# Altium project voice_palyer_test.PrjPcb
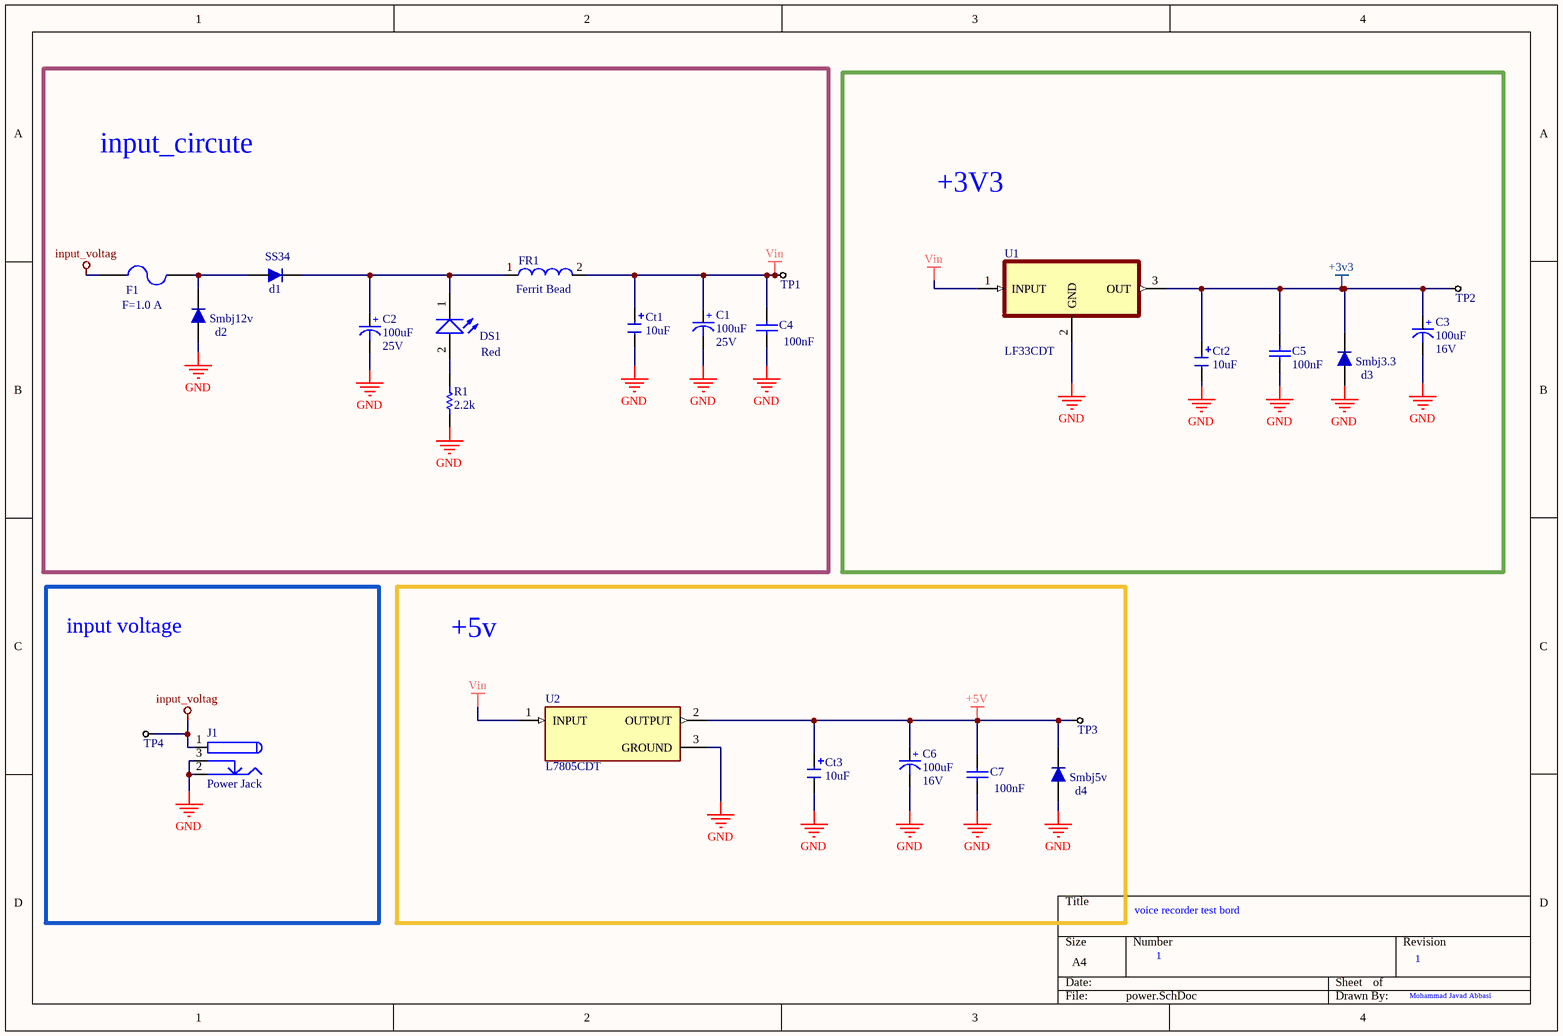
[diagram p0: power.SchDoc]
3 sheets, 98 parts. Net scope: global (net labels, ports and power ports of the same name join across sheets).
Board file: PCB1.PcbDoc
Sheets:
  power.SchDoc
  MCU.SchDoc
  other.SchDoc

## Sheet power.SchDoc
size A4; SheetNumber: 1; SheetTotal: 3

### Parts
C1  Voltage: 25V  [cap 03]  (hidden comment: 100uF)
C2  Voltage: 25V  [cap 03]  (hidden comment: 100uF)
C3  Voltage: 16V  [cap 03]  (hidden comment: 100uF)
C4  value 100nF  [CAP805]
C5  value 100nF  [CAP805]
C6  Voltage: 16V  [cap 03]  (hidden comment: 100uF)
C7  value 100nF  [CAP805]
Ct1  10uF  [Tantalium Size B]
Ct2  10uF  [Tantalium Size B]
Ct3  10uF  [Tantalium Size B]
d1  SS34  [DIODE SMA (DO-214AC)]
d2  Smbj12v  [DIODE SMA (DO-214AC)]
d3  Smbj3.3  [DIODE SMA (DO-214AC)]
d4  Smbj5v  [DIODE SMA (DO-214AC)]
DS1  Red  [LED 1206]
F1  F=1.0 A  [1206 FUSE]
FR1  Ferrit Bead  [RES1206]
J1  Power Jack  [Power Jack]
R1  2.2k  [RES0805]
TP1  (no value)  [TP10]
TP2  (no value)  [TP10]
TP3  (no value)  [TP10]
TP4  (no value)  [TP10]
U1  LF33CDT  [TO228P972X240-3N]
U2  L7805CDT  [VREG_L7805CDT]

### Blocks framed on the sheet
input_circute: C1 C2 C4 Ct1 d1 d2 DS1 F1 FR1 R1 TP1
+3V3: C3 C5 Ct2 d3 TP2 U1
input voltage: J1 TP4
+5v: C6 C7 Ct3 d4 TP3 U2

### Nets
+3v3: C3.1(+) C5.2 Ct2.1 d3.2 TP2.1(TP) U1.3(OUT)
+5V: C6.1(+) C7.2 Ct3.1 d4.2 TP3.1(TP) U2.2(OUTPUT)
GND: C1.2(-) C2.2(-) C3.2(-) C4.1 C5.1 C6.2(-) C7.1 Ct1.2 Ct2.2 Ct3.2 d2.1 d3.1 d4.1 J1.2 J1.3 R1.1 U1.2(GND) U2.3(GROUND)
input_voltag: F1.1 J1.1 TP4.1(TP)
Vin: C1.1(+) C4.2 Ct1.1 FR1.2 TP1.1(TP) U1.1(INPUT) U2.1(INPUT)
NetC2_1: C2.1(+) d1.2 DS1.1(K) FR1.1
Netd1_1: d1.1 d2.2 F1.2
NetDS1_2: DS1.2(A) R1.2

### Notes on the sheet
- voice recorder test bord
- 1
- Mohammad Javad Abbasi

### Library data of the parts
C1-C3 C6 = CAP_Polar: Polar Capacitor; Designer: Eng. Saeid Jorablo; Company: SJ Libraries; ComponentLink1Description: Datasheet; ComponentLink2Description: Reference; Publisher: SJ Unlimited; Mounting Technology: Surface Mount\Through-Hole; HelpURL: http://s3.picofile.com/file/7443264187/Coming_Soon_logo.gif; Status: Unreleased; Value: 100uF
C4 C5 C7 = Cap: Capacitor; Published: 8-Jun-2000; LatestRevisionDate: 17-Jul-2002; LatestRevisionNote: Re-released for DXP Platform.; Publisher: Altium Limited
Ct1-Ct3 = Capacitor Tantalium: Tantalium Cap 10uF .... 100uF; Value: 10uF
d1 = 1n4007 SMD M7: soutkey diod; Part. No: M7; Manufacturer: DC COMPONENTS; Designer: Abbas Basereh; Link: http://www.tme.eu/en/details/m7/smd-universal-diodes/dc-components/; Link: https://www.aliexpress.com/item/Smd-tube-1n4007-m7-SMA/1213719741.html?spm=2114.01010208.3.1.ZyZ7bC&ws_ab_test=searchweb0_0,searchweb201602_4_10065_10068_10084_10083_10080_10082_10081_10060_10061_10062_10056_10055_10054_10059_10099_10078_10079_427_10073_10103_10102_10096_10052_10050_10051,searchweb201603_4&btsid=db2be5ca-e560-400a-b91c-484ab5ee228b; Data: 16-12-2016
d2-d4 = 1n4007 SMD M7: Smbj5.0; Part. No: M7; Manufacturer: DC COMPONENTS; Designer: Abbas Basereh; Link: http://www.tme.eu/en/details/m7/smd-universal-diodes/dc-components/; Link: https://www.aliexpress.com/item/Smd-tube-1n4007-m7-SMA/1213719741.html?spm=2114.01010208.3.1.ZyZ7bC&ws_ab_test=searchweb0_0,searchweb201602_4_10065_10068_10084_10083_10080_10082_10081_10060_10061_10062_10056_10055_10054_10059_10099_10078_10079_427_10073_10103_10102_10096_10052_10050_10051,searchweb201603_4&btsid=db2be5ca-e560-400a-b91c-484ab5ee228b; Data: 16-12-2016
DS1 = LED SMD PACKAGE: SMD Mono-color Chip LED Waterclear; Part Number: 150080BS75000; Peak Wavelength: 465 nm; Forward Voltage: 3.2 V; Published Date: Jan 2017; Publisher: Ali Hafizi
F1 = Fuse SMD1206: SMD Fuses 1206; Designer: Abbas Basereh; Desc.: SMD Fuses 1206; Data: 16-12-2016
J1 = Power Jack: Designer: Saeid Jorablo; Company: Personal; Project Name: Laser; Adding Date: 10/21/2009
R1 = RES 0805 0.125W_1: RES 0805; Designer: Abbas Basereh; Desc.: RES SMD 0805; Data: 16-12-2016
TP1-TP4 = Test Point: Company: SJ Libraries; Designer: Eng. Saeid Jorablo; Mounting Technology: Surface Mount\Through-Hole; ComponentLink1Description: Datasheet; Pin Count: 0; Update Date: 6/3/2012; Category: MISC; HelpURL: http://s3.picofile.com/file/7443264187/Coming_Soon_logo.gif
U1 = LF33CDT: LDO, 0.45VDO, 1A, 3.3V, 1%, 3TO252; MF: {'manufacturer': u'STMicroelectronics'}; Package: None; Price: None; Value: *; MP: LF33CDT; Availability: Unavailable
U2 = L7805CDT: MF: {'manufacturer': u'STMicroelectronics'}; Package: None; Price: None; Value: *; MP: L7805CDT; Availability: Unavailable

## Sheet MCU.SchDoc
size A3; SheetNumber: 2; SheetTotal: 3; SPICEModelCacheLCPKTQCQ: <root> / <DocumentId>LCPKTQCQ</DocumentId> / <CacheFrame Number="0"> / <Model Name="hdsp_303a" Kind="CKT"> / <Text>* / * Diode Model Produced by Altium Ltd / * Date:  10-Mar-2004 / * / * Manufacturer: Agilent / * Component Name: HDSP-303A / * / * Parameters derived from information available in data sheet. / * / *                 anode-G / *                 |  anode-F / *                 |  |  comon-cathode / *                 |  |  |  anode-E / *                 |  |  |  |  anode-D / *                 |  |  |  |  |  anode-DP / *                 |  |  |  |  |  |  anode-C / *                 |  |  |  |  |  |  |  comon-cathode / *                 |  |  |  |  |  |  |  |  anode-B / *                 |  |  |  |  |  |  |  |  |  anode-A / *                 |  |  |  |  |  |  |  |  |  | / .SUBCKT HDSP_303A 1  2  3  4  5  6  7  8  9  10 / DA1  10  3  dHDSP_303A / DB1   9  3  dHDSP_303A / DC1   7  3  dHDSP_303A / DD1   5  3  dHDSP_303A / DE1   4  3  dHDSP_303A / DF1   2  3  dHDSP_303A / DG1   1  3  dHDSP_303A / DDP1  6  3  dHDSP_303A / DA2  10  8  dHDSP_303A / DB2   9  8  dHDSP_303A / DC2   7  8  dHDSP_303A / DD2   5  8  dHDSP_303A / DE2   4  8  dHDSP_303A / DF2   2  8  dHDSP_303A / DG2   1  8  dHDSP_303A / DDP2  6  8  dHDSP_303A / .MODEL dHDSP_303A D / + ( / +    IS = 4.59961571E-15 / +     N = 2.40621673 / +    RS = 1.90931135 / +    BV = 4.5 / +   IBV = 100u / + ) / .ENDS HDSP_303A</Text> / </Model> / </CacheFrame> / </root>
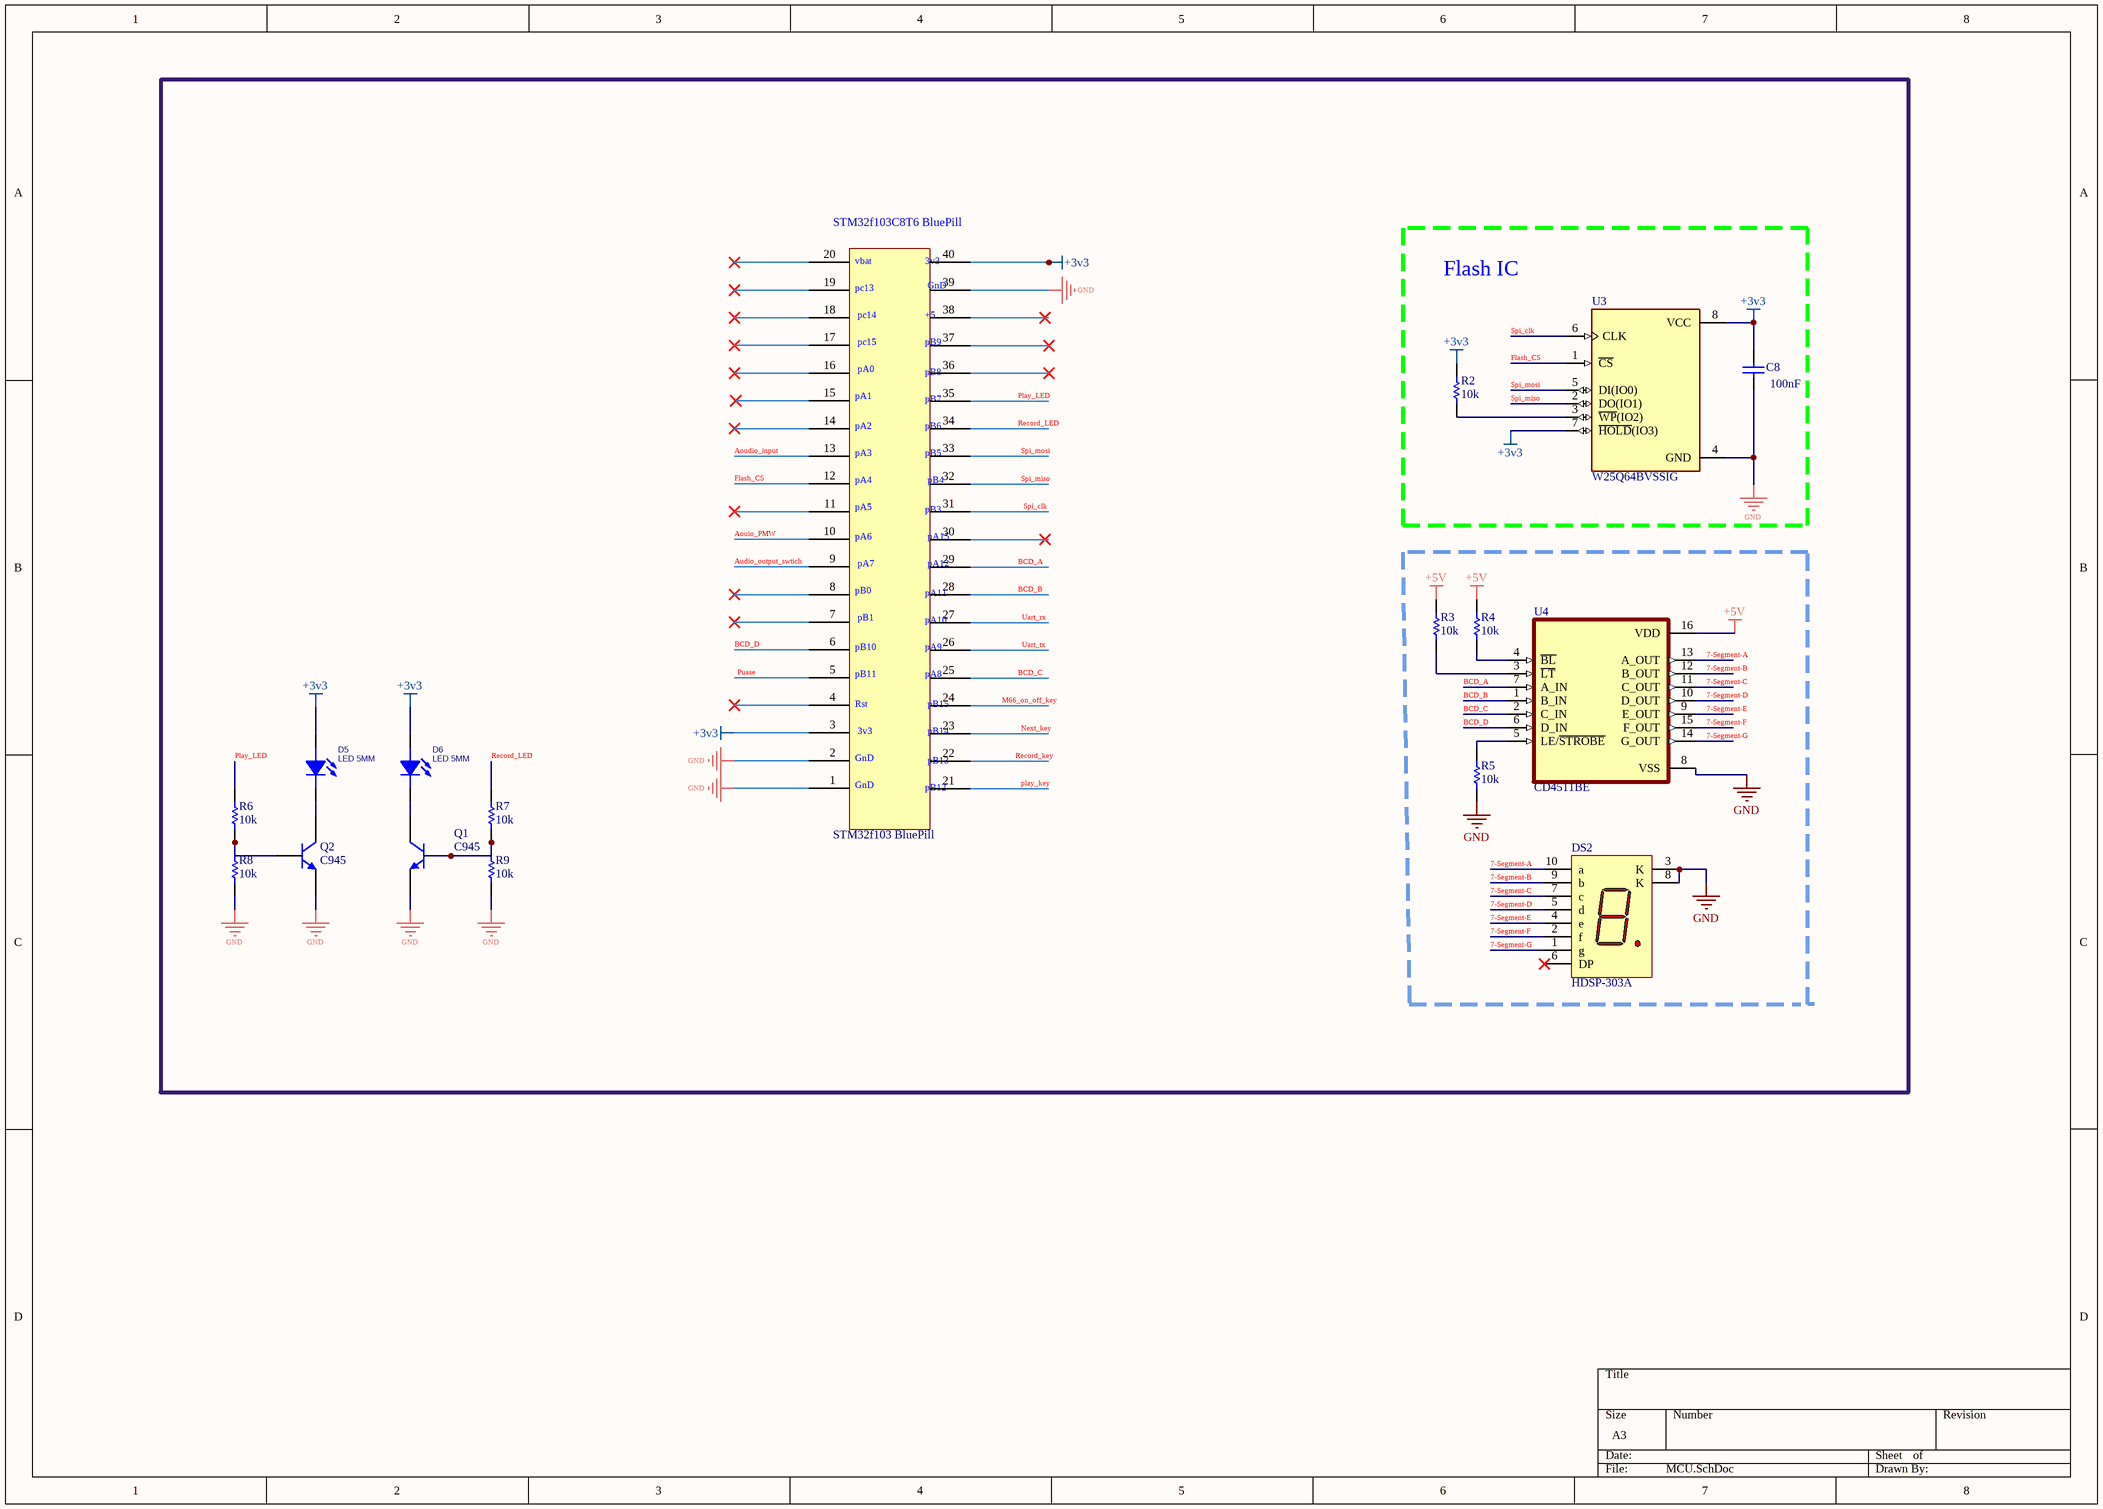
[diagram p1: MCU.SchDoc]

### Parts
C8  value 100nF  [CAP805]
D5  LED 5MM  [LED5MM_GRN]
D6  LED 5MM  [LED5MM_RED]
DS2  HDSP-303A  [F-10]
Q1  C945  [C945]
Q2  C945  [C945]
R2  10k  [RES0805]
R3  10k  [RES0805]
R4  10k  [RES0805]
R5  10k  [RES0805]
R6  10k  [RES0805]
R7  10k  [RES0805]
R8  10k  [RES0805]
R9  10k  [RES0805]
STM1  STM32f103 BluePill  [BluePill]
U3  W25Q64BVSSIG  [SOIC127P790X216-8N]
U4  CD4511BE  [DIP794W45P254L1969H508Q16]

### Blocks framed on the sheet
Flash IC: C8 R2 U3

### Nets
+3v3: C8.2 D5.1(ANODE) D6.1(ANODE) R2.2 STM1.3 STM1.40 U3.7(~{HOLD}(IO3)) U3.8(VCC)
+5V: R3.1 R4.1 U4.16(VDD)
GND: C8.1 DS2.3(K) DS2.8(K) Q1.1(E) Q2.1(E) R5.1 R8.1 R9.1 STM1.1 STM1.2 STM1.39 U3.4(GND) U4.8(VSS)
7-Segment-A: DS2.10(a) U4.13(A_OUT)
7-Segment-B: DS2.9(b) U4.12(B_OUT)
7-Segment-C: DS2.7(c) U4.11(C_OUT)
7-Segment-D: DS2.5(d) U4.10(D_OUT)
7-Segment-E: DS2.4(e) U4.9(E_OUT)
7-Segment-F: DS2.2(f) U4.15(F_OUT)
7-Segment-G: DS2.1(g) U4.14(G_OUT)
Aoudio_input: STM1.13
Aouio_PMW: STM1.10
Audio_output_swtich: STM1.9
BCD_A: STM1.29 U4.7(A_IN)
BCD_B: STM1.28 U4.1(B_IN)
BCD_C: STM1.25 U4.2(C_IN)
BCD_D: STM1.6 U4.6(D_IN)
Flash_CS: STM1.12 U3.1(~{CS})
M66_on_off_key: STM1.24
Next_key: STM1.23
play_key: STM1.21
Play_LED: R6.2 STM1.35
Puase: STM1.5
Record_key: STM1.22
Record_LED: R7.2 STM1.34
Spi_clk: STM1.31 U3.6(CLK)
Spi_miso: STM1.32 U3.2(DO(IO1))
Spi_mosi: STM1.33 U3.5(DI(IO0))
Uart_rx: STM1.27
Uart_tx: STM1.26
NetD5_2: D5.2(CATHODE) Q2.2(C)
NetD6_2: D6.2(CATHODE) Q1.2(C)
NetQ1_3: Q1.3(B) R7.1 R9.2
NetQ2_3: Q2.3(B) R6.1 R8.2
NetR2_1: R2.1 U3.3(~{WP}(IO2))
NetR3_2: R3.2 U4.3(~{LT})
NetR4_2: R4.2 U4.4(~{BL})
NetR5_2: R5.2 U4.5(LE/~{STROBE})

Not connected (* = marked no-connect by the designer): DS2 6(DP)*; STM1 4* 7* 8* 11* 14* 15* 16* 17* 18* 19* 20* 30* 36* 37* 38*

### Notes on the sheet
- (in symbol STM32f103 BluePill) STM32f103C8T6 BluePill; vbat; 3v3; GnD; pc13; pc14; +5; pc15; pB9; pA0; pB8; pA1; pB7; pA2; pB6; pA3; pB5; pA4; pB4; pA5; pB3; pA6; pA15; pA7; pA12; pB0; pA11; pB1; pA10; pB10; pA9; pB11; pA8; Rst; pB15; pB14; pB13; pB12

### Library data of the parts
C8 = Cap: Capacitor; Published: 8-Jun-2000; LatestRevisionDate: 17-Jul-2002; LatestRevisionNote: Re-released for DXP Platform.; Publisher: Altium Limited
D5 D6 = LED 5MM: Light Emitting Diode; Designer: Abbas Basereh; Data: 16-12-2016; Link: *; Part.No: *
DS2 = HDSP-303A: 10 mm Slim Font, AlGaAs 7-Segment Display: CC, RH DP; LuminousIntensity: 320 ucd (Minimum).; LED_Colour: AlGaAs Red; Published: 26-May-2004; LatestRevisionDate: 11-Oct-2004; LatestRevisionNote: Display outline superimposed on PCB Footprint.; DatasheetDocument: 1-Oct-2001; PackageDocument: 17-Jan-2002; PackageReference: F-10; Publisher: Altium Limited; ComponentLink1Description: Manufacturer Link; ComponentLink1URL: http://www.agilent.com/; ComponentLink2Description: Datasheet; ComponentLink2URL: http://cp.literature.agilent.com/litweb/pdf/5988-4352EN.pdf
Q1 Q2 = C945 2: NPN Transistor; Designer: Saeid Jorablo; Company: IPA CO; Last Update Time: 2008/08/04; Value: C945
R2-R9 = RES 0805 0.125W_1: as R1 on sheet power; Data: 16-12-2016
U3 = W25Q64BVSSIG: IC FLASH 64MBIT 80MHZ 8SOIC; MF: {'manufacturer': u'Winbond Electronics'}; Package: None; Price: None; Value: *; MP: W25Q64BVSSIG; Availability: Unavailable
U4 = CD4511BE: Price: None; MP: CD4511BE; Availability: Unavailable; Value: *; Package: None

## Sheet other.SchDoc
size A2; SheetNumber: 3; SheetTotal: 3
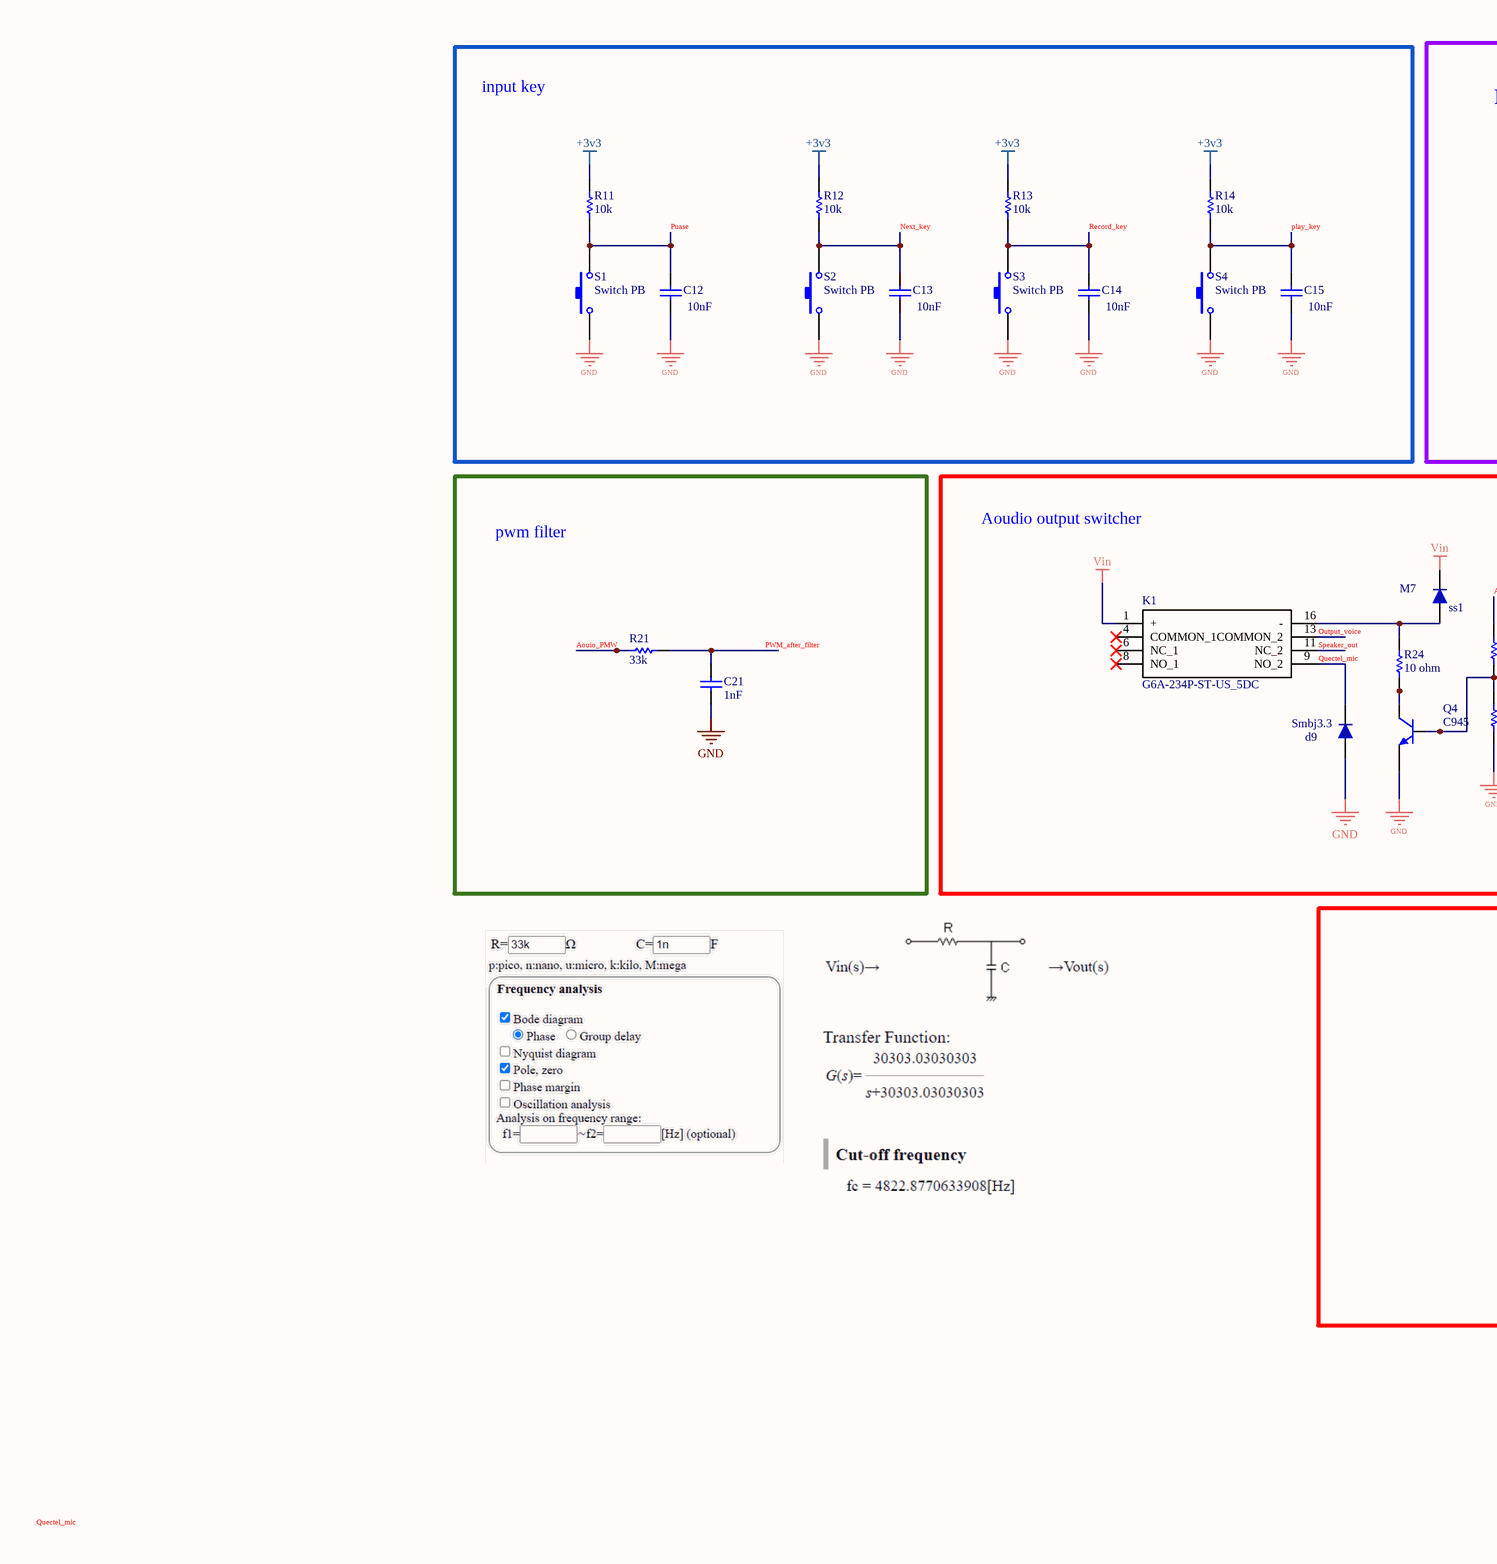
[diagram p2: other.SchDoc, left]
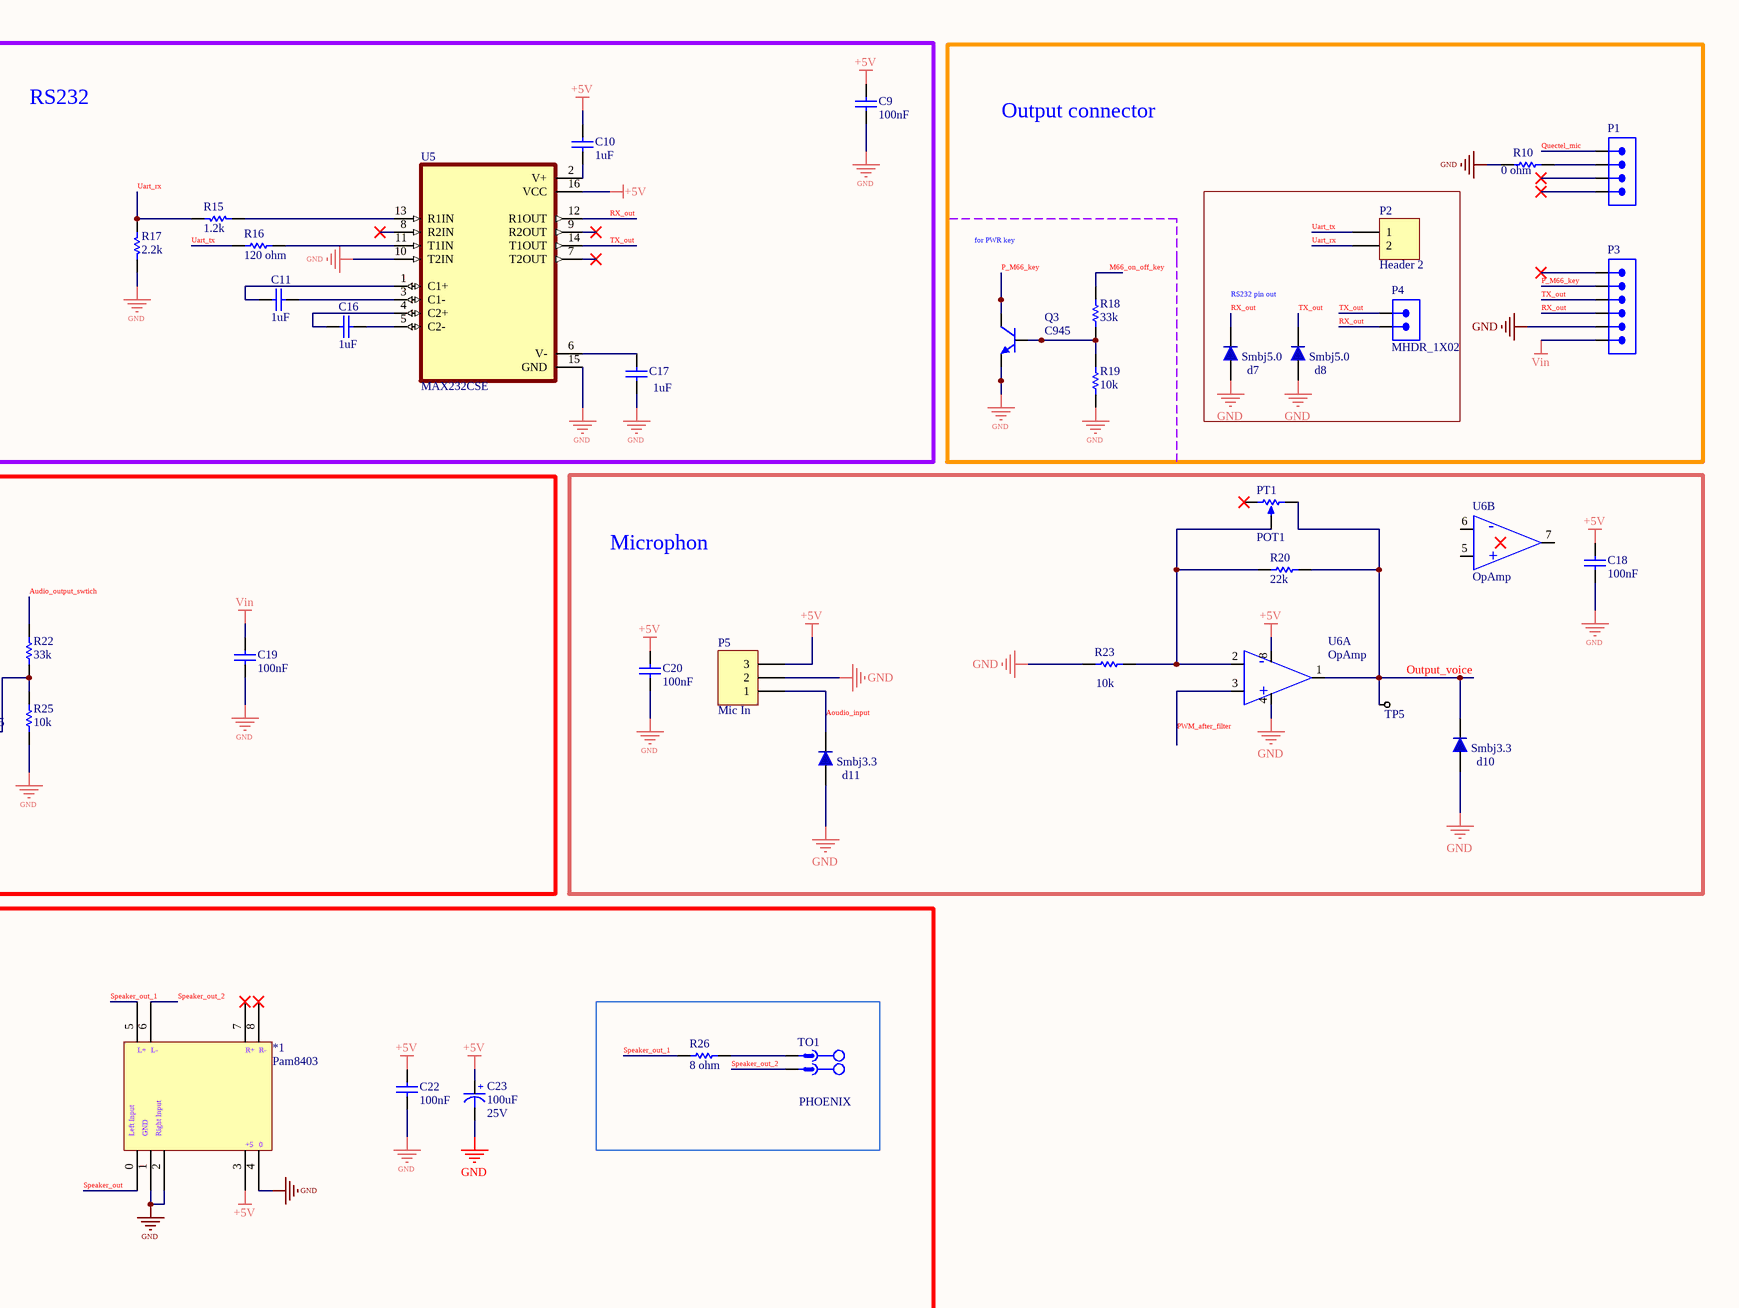
[diagram p3: other.SchDoc, right]

### Parts
*1  Pam8403  [PAM8403]
C9  value 100nF  [CAP805]
C10  value 1uF  [CAP805]
C11  value 1uF  [CAP805]
C12  value 10nF  [CAP805]
C13  value 10nF  [CAP805]
C14  value 10nF  [CAP805]
C15  value 10nF  [CAP805]
C16  value 1uF  [CAP805]
C17  value 1uF  [CAP805]
C18  value 100nF  [CAP805]
C19  value 100nF  [CAP805]
C20  value 100nF  [CAP805]
C21  value 1nF  [CAP805]
C22  value 100nF  [CAP805]
C23  Voltage: 25V  [cap 03]  (hidden comment: 100uF)
d7  Smbj5.0  [DIODE SMA (DO-214AC)]
d8  Smbj5.0  [DIODE SMA (DO-214AC)]
d9  Smbj3.3  [DIODE SMA (DO-214AC)]
d10  Smbj3.3  [DIODE SMA (DO-214AC)]
d11  Smbj3.3  [DIODE SMA (DO-214AC)]
K1  G6A-234P-ST-US_5DC  [G6A234PSTUS5DC]
P1  xh 4pin  [XH 4 PIN-S]  (value not drawn)
P2  Header 2  [HDR1X2]
P3  xh 6pin  [XH 6 PIN-S]  (value not drawn)
P4  MHDR_1X02  [MHDR1X02-254P]
P5  Mic In  [HDR1X3]
PT1  POT1  [POT1]
Q3  C945  [C945]
Q4  C945  [C945]
R10  0 ohm  [RES0805]
R11  10k  [RES0805]
R12  10k  [RES0805]
R13  10k  [RES0805]
R14  10k  [RES0805]
R15  1.2k  [RES0805]
R16  120 ohm  [RES0805]
R17  2.2k  [RES0805]
R18  33k  [RES0805]
R19  10k  [RES0805]
R20  22k  [RES0805]
R21  33k  [RES0805]
R22  33k  [RES0805]
R23  10k  [RES0805]
R24  10 ohm  [RES0805]
R25  10k  [RES0805]
R26  8 ohm  [RES0805]
S1  Switch PB  [Switch - Push to On]
S2  Switch PB  [Switch - Push to On]
S3  Switch PB  [Switch - Push to On]
S4  Switch PB  [Switch - Push to On]
ss1  M7  [DIODE SMA (DO-214AC)]
TO1  PHOENIX  [CON_MSTBA02]
TP5  (no value)  [TP10]
U5  MAX232CSE  [SOIC127P600X175-16N]
U6  OpAmp  [DIP8]  (parts A,B of 2)

### Blocks framed on the sheet
RS232: C9-C11 C16 C17 R15-R17 U5
input key: C12-C15 R11-R14 S1-S4
Output connector: P1 P3 Q3 R10 R18 R19
RS232 pin out: d7 d8 P2 P4
Microphon: C18 C20 d10 d11 P5 PT1 R20 R23 TP5 U6
pwm filter: C21 R21
Aoudio output switcher: C19 d9 K1 Q4 R22 R24 R25 ss1

### Nets
+3v3: R11.2 R12.2 R13.2 R14.2
+5V: *1.3 C9.1 C10.1 C18.1 C20.1 C22.1 C23.1(+) P5.3 U5.16(VCC) U6.8(V+)
GND: *1.1 *1.2 *1.4 C9.2 C12.1 C13.1 C14.1 C15.1 C17.1 C18.2 C19.2 C20.2 C21.2 C22.2 C23.2(-) d7.1 d8.1 d9.1 d10.1 d11.1 P3.5 P5.2 Q3.1(E) Q4.1(E) R10.2 R17.1 R19.2 R23.2 R25.2 S1.1 S2.1 S3.1 S4.1 U5.10(T2IN) U5.15(GND) U6.4(V-)
Vin: C19.1 K1.1(+) P3.6 ss1.2
Aoudio_input: d11.2 P5.1
Aouio_PMW: R21.2
Audio_output_swtich: R22.1
M66_on_off_key: R18.1
Next_key: C13.2 R12.1 S2.2
Output_voice: d10.2 K1.13(COMMON_2) PT1.2(BOT) R20.1 TP5.1(TP) U6.1(Output)
P_M66_key: P3.2 Q3.2(C)
play_key: C15.2 R14.1 S4.2
Puase: C12.2 R11.1 S1.2
PWM_after_filter: C21.1 R21.1 U6.3(Noninverter_Input)
Quectel_mic: d9.2 K1.9(NO_2) P1.1
Record_key: C14.2 R13.1 S3.2
RX_out: d7.2 P3.4 P4.2 U5.12(R1OUT)
Speaker_out: *1.0 K1.11(NC_2)
Speaker_out_1: *1.5 R26.1
Speaker_out_2: *1.6 TO1.2
TX_out: d8.2 P3.3 P4.1 U5.14(T1OUT)
Uart_rx: P2.2 R15.1 R17.2
Uart_tx: P2.1 R16.2
NetC10_2: C10.2 U5.2(V+)
NetC11_1: C11.1 U5.3(C1-)
NetC11_2: C11.2 U5.1(C1+)
NetC16_1: C16.1 U5.5(C2-)
NetC16_2: C16.2 U5.4(C2+)
NetC17_2: C17.2 U5.6(V-)
NetK1_16: K1.16(-) R24.1 ss1.1
NetP1_2: P1.2 R10.1
NetPT1_3: PT1.3(TAP) R20.2 R23.1 U6.2(Inverter_Input)
NetQ3_3: Q3.3(B) R18.2 R19.1
NetQ4_2: Q4.2(C) R24.2
NetQ4_3: Q4.3(B) R22.2 R25.1
NetR15_2: R15.2 U5.13(R1IN)
NetR16_1: R16.1 U5.11(T1IN)
NetR26_2: R26.2 TO1.1

Not connected (* = marked no-connect by the designer): *1 7* 8*; K1 4(COMMON_1)* 6(NC_1)* 8(NO_1)*; P1 3* 4*; P3 1*; PT1 1(TOP)*; U5 7(T2OUT)* 8(R2IN)* 9(R2OUT)*; U6 5(Noninverter_Input) 6(Inverter_Input) 7(Output)

### Notes on the sheet
- for PWR key
- Labels drawn without touching a wire or pin: Quectel_mic
- (in symbol OpAmp, part A) -; +
- (in symbol OpAmp, part B) -; +
- (in symbol Pam8403) L+; L-; R+; R-; Left Input; GND; Right Input; +5

### Library data of the parts
C9-C22 = Cap: Capacitor; Published: 8-Jun-2000; LatestRevisionDate: 17-Jul-2002; LatestRevisionNote: Re-released for DXP Platform.; Publisher: Altium Limited
C23 = CAP_Polar: as C1 on sheet power; ComponentLink1Description: Datasheet; ComponentLink2Description: Reference; Publisher: SJ Unlimited; Mounting Technology: Surface Mount\Through-Hole; HelpURL: http://s3.picofile.com/file/7443264187/Coming_Soon_logo.gif; Status: Unreleased; Value: 100uF
d7 d8 = 1n4007 SMD M7: Part. No: M7; Manufacturer: DC COMPONENTS; Designer: Abbas Basereh; Link: http://www.tme.eu/en/details/m7/smd-universal-diodes/dc-components/; Link: https://www.aliexpress.com/item/Smd-tube-1n4007-m7-SMA/1213719741.html?spm=2114.01010208.3.1.ZyZ7bC&ws_ab_test=searchweb0_0,searchweb201602_4_10065_10068_10084_10083_10080_10082_10081_10060_10061_10062_10056_10055_10054_10059_10099_10078_10079_427_10073_10103_10102_10096_10052_10050_10051,searchweb201603_4&btsid=db2be5ca-e560-400a-b91c-484ab5ee228b; Data: 16-12-2016
d9-d11 = 1n4007 SMD M7: as d2 on sheet power; Link: http://www.tme.eu/en/details/m7/smd-universal-diodes/dc-components/; Link: https://www.aliexpress.com/item/Smd-tube-1n4007-m7-SMA/1213719741.html?spm=2114.01010208.3.1.ZyZ7bC&ws_ab_test=searchweb0_0,searchweb201602_4_10065_10068_10084_10083_10080_10082_10081_10060_10061_10062_10056_10055_10054_10059_10099_10078_10079_427_10073_10103_10102_10096_10052_10050_10051,searchweb201603_4&btsid=db2be5ca-e560-400a-b91c-484ab5ee228b; Data: 16-12-2016
K1 = G6A-234P-ST-US_5DC: Relay or Contactor; Manufacturer_Name: Omron Electronics; Manufacturer_Part_Number: G6A-234P-ST-US 5DC; Datasheet Link: https://componentsearchengine.com/Datasheets/2/G6A-234P-ST-US 5DC.pdf; Height: 8.4mm; Arrow Part Number: G6A-234P-ST-US 5DC; Arrow Price/Stock: https://www.arrow.com/en/products/g6a234pstus5dc/omron
P1 = MHDR_1X04
P2 = Header 2: Header, 2-Pin; LatestRevisionDate: 17-Jul-2002; LatestRevisionNote: Re-released for DXP Platform.; Publisher: Altium Limited
P3 = MHDR_1X06
P4 = MHDR_1X02: Male Header 1X02
P5 = Header 3: Header, 3-Pin; LatestRevisionDate: 17-Jul-2002; LatestRevisionNote: Re-released for DXP Platform.; Publisher: Altium Limited
PT1 = POT1: Variable Potentiometer standing; Designer: Seyed Mohsen Ghasemian; WEB: www.picpars.com
Q3 Q4 = C945 2: as Q1 on sheet MCU; Last Update Time: 2008/08/04; Value: C945
R10 R18 R19 R22 R24-R26 = RES 0805 0.125W_5: RES 0805; Designer: Abbas Basereh; Desc.: RES SMD 0805; Data: 16-12-2016
R11-R17 R20 R21 R23 = RES 0805 0.125W_1: as R1 on sheet power; Data: 16-12-2016
S1-S4 = Switch PB: Push Button Switch
ss1 = 1n4007 SMD M7: Standard Rectifiers; Manufacturer: DC COMPONENTS; Designer: Abbas Basereh; Link: http://www.tme.eu/en/details/m7/smd-universal-diodes/dc-components/; Part. No: M7; Link: https://www.aliexpress.com/item/Smd-tube-1n4007-m7-SMA/1213719741.html?spm=2114.01010208.3.1.ZyZ7bC&ws_ab_test=searchweb0_0,searchweb201602_4_10065_10068_10084_10083_10080_10082_10081_10060_10061_10062_10056_10055_10054_10059_10099_10078_10079_427_10073_10103_10102_10096_10052_10050_10051,searchweb201603_4&btsid=db2be5ca-e560-400a-b91c-484ab5ee228b; Data: 16-12-2016
TO1 = CON_Phoenix_MSTB_02: 2 Pitch: 5.08 mm Color: green Contact surface: Tin Assembly; Manufacturer: PHOENIX CONTACT; Connector type: PCB Terminal Block; designer: ABBAS BASEREH; Max Current: 12 A; Positions: 2; Voltage: 320 V; Category: Connector; ComponentLink1Description: Header, Nominal current: 12 A Rated voltage (III/2): 320 V Number of positions: 2 Pitch: 5.08 mm Color: green Contact surface: Tin Assembly: Soldering  DESIGNER:ABBAS BASEREH; ComponentLink2Description: Reference; Mounting Technology: Through-Hole; Pin Count: 2; Revision 1: 2017-3-1; Status: Unreleased; PART.NO: PHOENIX
TP5 = Test Point: as TP1 on sheet power; Mounting Technology: Surface Mount\Through-Hole; ComponentLink1Description: Datasheet; Pin Count: 0; Update Date: 6/3/2012; Category: MISC; HelpURL: http://s3.picofile.com/file/7443264187/Coming_Soon_logo.gif
U5 = MAX232CSE: MF: {'manufacturer': u'Analog Devices'}; Package: None; Price: None; Value: *; MP: MAX232CSE; Availability: Unavailable
U6 = OpAmp: Dual Low Noise Operational Amplifier (OpAmp)

## Nets that join several sheets
+3v3: power (6 pins), MCU (8 pins), other (R11.2 R12.2 R13.2 R14.2)
+5V: power (6 pins), MCU (R3.1 R4.1 U4.16), other (10 pins)
GND: power (18 pins), MCU (13 pins), other (36 pins)
Vin: power (7 pins), other (C19.1 K1.1 P3.6 ss1.2)
Aoudio_input: MCU (STM1.13), other (d11.2 P5.1)
Aouio_PMW: MCU (STM1.10), other (R21.2)
Audio_output_swtich: MCU (STM1.9), other (R22.1)
M66_on_off_key: MCU (STM1.24), other (R18.1)
Next_key: MCU (STM1.23), other (C13.2 R12.1 S2.2)
play_key: MCU (STM1.21), other (C15.2 R14.1 S4.2)
Puase: MCU (STM1.5), other (C12.2 R11.1 S1.2)
Record_key: MCU (STM1.22), other (C14.2 R13.1 S3.2)
Uart_rx: MCU (STM1.27), other (P2.2 R15.1 R17.2)
Uart_tx: MCU (STM1.26), other (P2.1 R16.2)